# Altium schematic sheet tang1.SchDoc
size A3
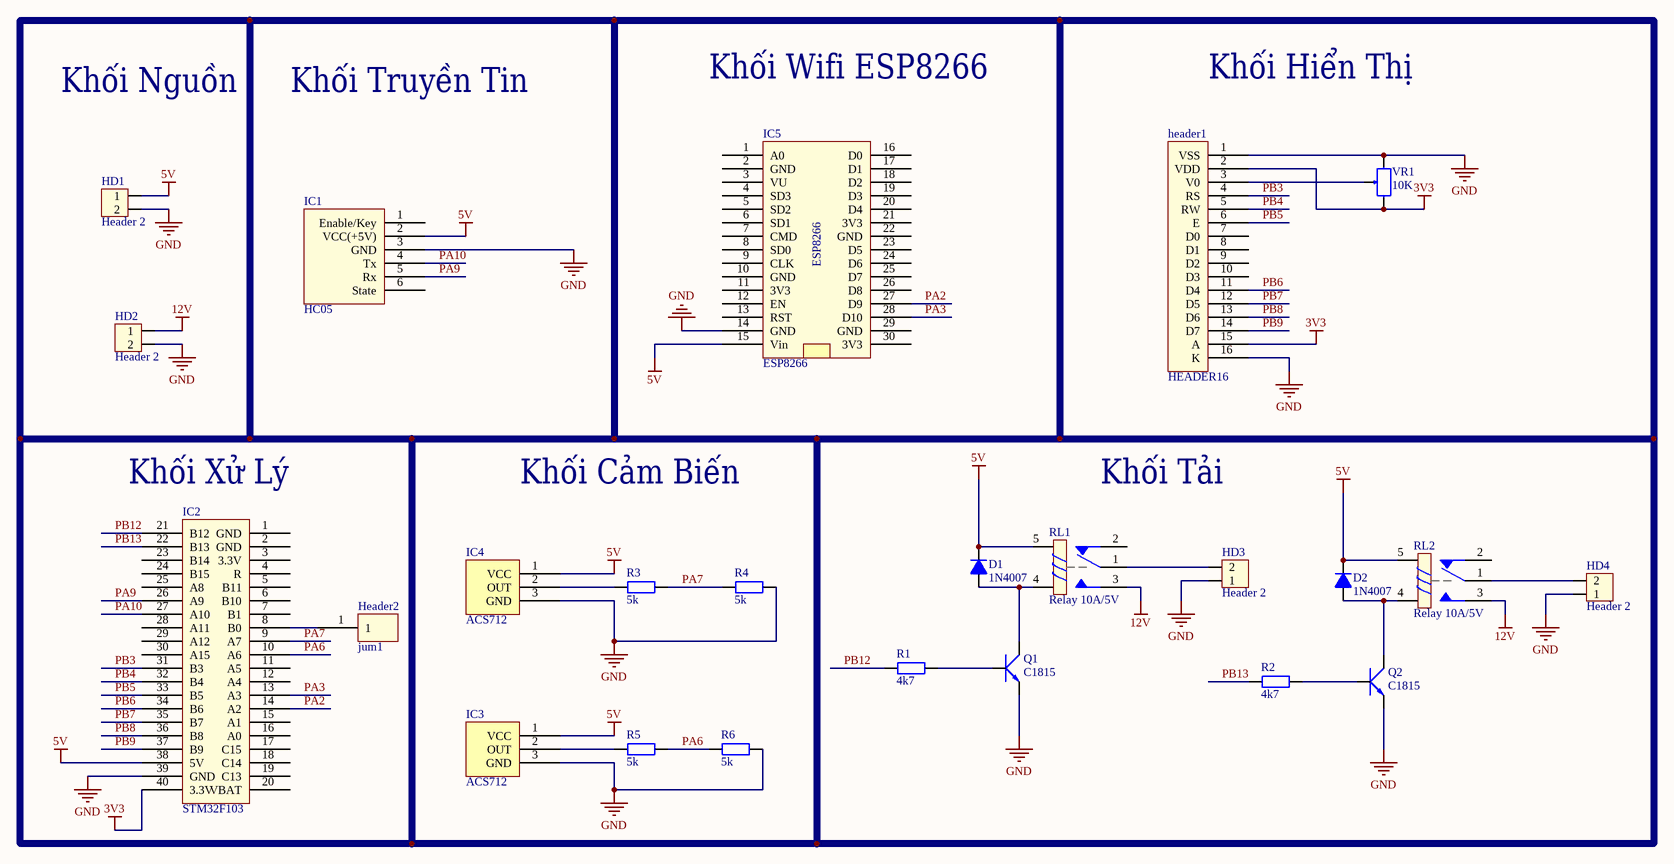
[diagram p0: tang1.SchDoc]

## Parts
D1  1N4007  [D1A]
D2  1N4007  [D1A]
HD1  Header 2  [HED2]
HD2  Header 2  [HED2]
HD3  Header 2  [HED2]
HD4  Header 2  [HED2]
header1  HEADER16  [header16_pin]
Header2  jum1  [PCBComponent_1]
IC1  HC05  [HC05_Pin]
IC2  STM32F103  [STM32]
IC3  ACS712  [PCBComponent_1]
IC4  ACS712  [PCBComponent_1]
IC5  ESP8266  [ESP8266 V2]
Q1  C1815  [QTO-92]
Q2  C1815  [QTO-92]
R1  4k7  [R1/4W]
R2  4k7  [R1/4W]
R3  5k  [R1/4W]
R4  5k  [R1/4W]
R5  5k  [R1/4W]
R6  5k  [R1/4W]
RL1  Relay 10A/5V  [RL_SPDT_10A]
RL2  Relay 10A/5V  [RL_SPDT_10A]
VR1  10K  [VR]

## Nets
3V3: header1.2(VDD) header1.15(A) IC2.40(3.3V) VR1.1
5V: D1.2(K) D2.2(K) HD1.1 IC1.2(VCC(+5V)) IC2.38(5V) IC3.1(VCC) IC4.1(VCC) IC5.15(Vin) RL1.5 RL2.5
12V: HD2.1 RL1.3 RL2.3
GND: HD1.2 HD2.2 HD3.1 HD4.1 header1.1(VSS) header1.16(K) IC1.3(GND) IC2.39(GND) IC3.3(GND) IC4.3(GND) IC5.14(GND) Q1.1(E) Q2.1(E) R4.2 R6.2 VR1.3
PA2: IC2.14(A2) IC5.27(D9)
PA3: IC2.13(A3) IC5.28(D10)
PA6: IC2.10(A6) R5.2 R6.1
PA7: IC2.9(A7) R3.2 R4.1
PA9: IC1.5(Rx) IC2.26(A9)
PA10: IC1.4(Tx) IC2.27(A10)
PB3: header1.4(RS) IC2.31(B3)
PB4: header1.5(RW) IC2.32(B4)
PB5: header1.6(E) IC2.33(B5)
PB6: header1.11(D4) IC2.34(B6)
PB7: header1.12(D5) IC2.35(B7)
PB8: header1.13(D6) IC2.36(B8)
PB9: header1.14(D7) IC2.37(B9)
PB12: IC2.21(B12) R1.1
PB13: IC2.22(B13) R2.1
NetD1_1: D1.1(A) Q1.2(C) RL1.4
NetD2_1: D2.1(A) Q2.2(C) RL2.4
NetHD3_2: HD3.2 RL1.1
NetHD4_2: HD4.2 RL2.1
Netheader1_3: header1.3(V0) VR1.2
NetHeader2_1: Header2.1 IC2.8(B0)
NetIC3_2: IC3.2(OUT) R5.1
NetIC4_2: IC4.2(OUT) R3.1
NetQ1_3: Q1.3(B) R1.2
NetQ2_3: Q2.3(B) R2.2

Not connected (* = marked no-connect by the designer): header1 7(D0) 8(D1) 9(D2) 10(D3); IC1 1(Enable/Key) 6(State); IC2 1(GND) 2(GND) 3(3.3V) 4(R) 5(B11) 6(B10) 7(B1) 11(A5) 12(A4) 15(A1) 16(A0) 17(C15) 18(C14) 19(C13) 20(VBAT) 23(B14) 24(B15) 25(A8) 28(A11) 29(A12) 30(A15); IC5 1(A0) 2(GND) 3(VU) 4(SD3) 5(SD2) 6(SD1) 7(CMD) 8(SD0) 9(CLK) 10(GND) 11(3V3) 12(EN) 13(RST) 16(D0) 17(D1) 18(D2) 19(D3) 20(D4) 21(3V3) 22(GND) 23(D5) 24(D6) 25(D7) 26(D8) 29(GND) 30(3V3); RL1 2; RL2 2

## Notes on the sheet
- Khối Wifi ESP8266
- Khối Hiển Thị
- Khối Nguồn
- Khối Truyền Tin
- (near IC2) Khối Xử Lý
- Khối Cảm Biến
- Khối Tải

## Library data of the parts
D1 D2 = D1A: Diode 1A; Value: 1N4007
HD1-HD4 = Hed2: Header 2 (Green); Value: Header 2
IC5 = ESP8266_V2
Q1 Q2 = C1815: NPN 600mW, ECB; Value: C1815
R1-R6 = R1/4W: Resistor 1/4W; Value: R1/4W - 1K
RL1 RL2 = Relay 1: Relay SPDT,10A - 12VDC 5 Pin; Value: Relay SPDT, 10A, 12V
VR1 = VR: Var Resistor; Value: VR 10K